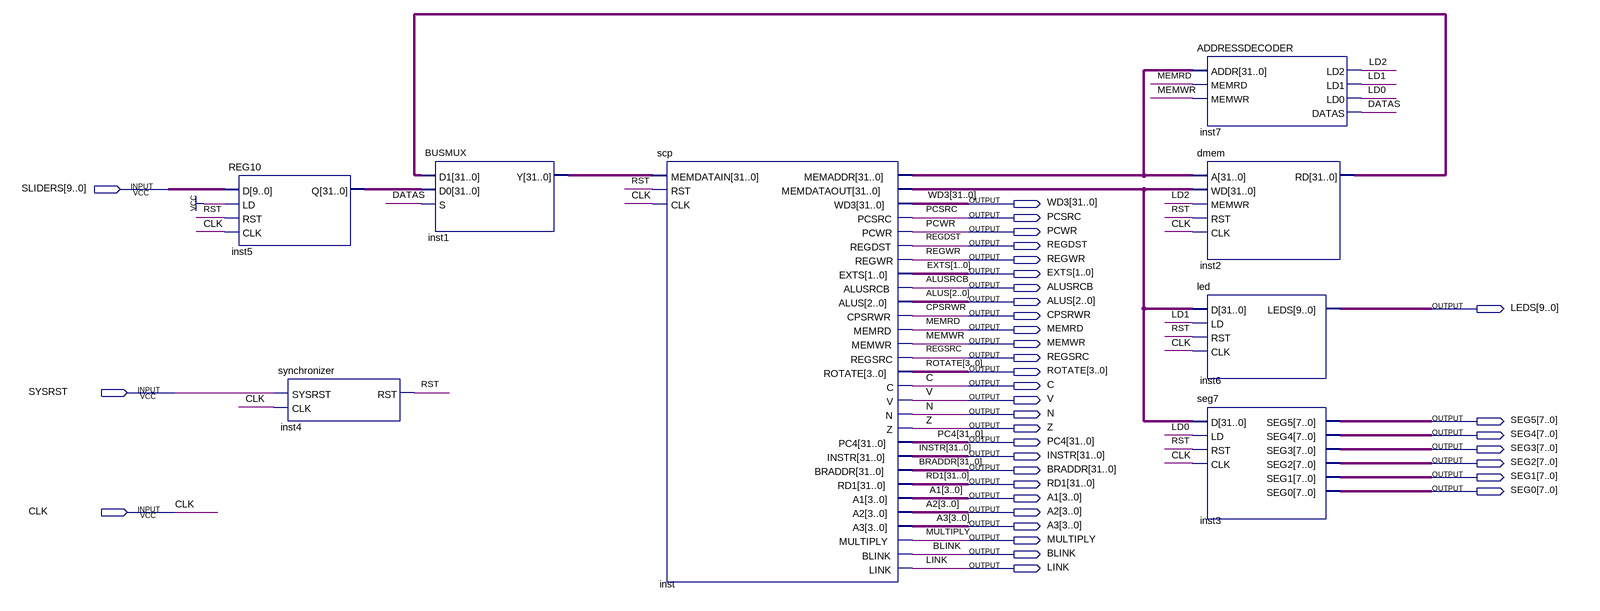
[diagram p0: schematic sheet]
// Quartus schematic system.bdf as structural Verilog: 8 symbols, 37 pins
module system (
  input  [9:0] SLIDERS,
  input  SYSRST,
  input  CLK,
  output [31:0] WD3,
  output PCSRC,
  output PCWR,
  output REGDST,
  output REGWR,
  output [1:0] EXTS,
  output ALUSRCB,
  output [2:0] ALUS,
  output [9:0] LEDS,
  output CPSRWR,
  output MEMRD,
  output MEMWR,
  output REGSRC,
  output [3:0] ROTATE,
  output C,
  output V,
  output N,
  output [7:0] SEG5,
  output Z,
  output [7:0] SEG4,
  output [31:0] PC4,
  output [7:0] SEG3,
  output [31:0] INSTR,
  output [7:0] SEG2,
  output [31:0] BRADDR,
  output [7:0] SEG1,
  output [31:0] RD1,
  output [7:0] SEG0,
  output [3:0] A1,
  output [3:0] A2,
  output [3:0] A3,
  output MULTIPLY,
  output BLINK,
  output LINK
);

  wire DATAS, LD0, LD1, LD2, RST;
  wire [31:0] inst1_y, inst2_rd, inst5_q, inst_memaddr, inst_memdataout;

  REG10 inst5 (.D(SLIDERS), .LD(1'b1), .RST(RST), .CLK(CLK), .Q(inst5_q));
  synchronizer inst4 (.SYSRST(SYSRST), .CLK(CLK), .RST(RST));
  BUSMUX inst1 (.D1(inst2_rd), .D0(inst5_q), .S(DATAS), .Y(inst1_y));
  scp inst (
    .MEMDATAIN(inst1_y), .RST(RST), .CLK(CLK), .MEMADDR(inst_memaddr), .MEMDATAOUT(inst_memdataout),
    .WD3(WD3), .PCSRC(PCSRC), .PCWR(PCWR), .REGDST(REGDST), .REGWR(REGWR), .EXTS(EXTS), .ALUSRCB(ALUSRCB),
    .ALUS(ALUS), .CPSRWR(CPSRWR), .MEMRD(MEMRD), .MEMWR(MEMWR), .REGSRC(REGSRC), .ROTATE(ROTATE), .C(C),
    .V(V), .N(N), .Z(Z), .PC4(PC4), .INSTR(INSTR), .BRADDR(BRADDR), .RD1(RD1), .A1(A1), .A2(A2), .A3(A3),
    .MULTIPLY(MULTIPLY), .BLINK(BLINK), .LINK(LINK));
  ADDRESSDECODER inst7 (
    .ADDR(inst_memaddr), .MEMRD(MEMRD), .MEMWR(MEMWR), .LD2(LD2), .LD1(LD1), .LD0(LD0), .DATAS(DATAS));
  dmem inst2 (.A(inst_memaddr), .WD(inst_memdataout), .MEMWR(LD2), .RST(RST), .CLK(CLK), .RD(inst2_rd));
  led inst6 (.D(inst_memdataout), .LD(LD1), .RST(RST), .CLK(CLK), .LEDS(LEDS));
  seg7 inst3 (
    .D(inst_memdataout), .LD(LD0), .RST(RST), .CLK(CLK), .SEG5(SEG5), .SEG4(SEG4), .SEG3(SEG3), .SEG2(SEG2),
    .SEG1(SEG1), .SEG0(SEG0));
endmodule
